# EAGLE design PCB ARDUINO NANO (EAGLE 9.6.2)
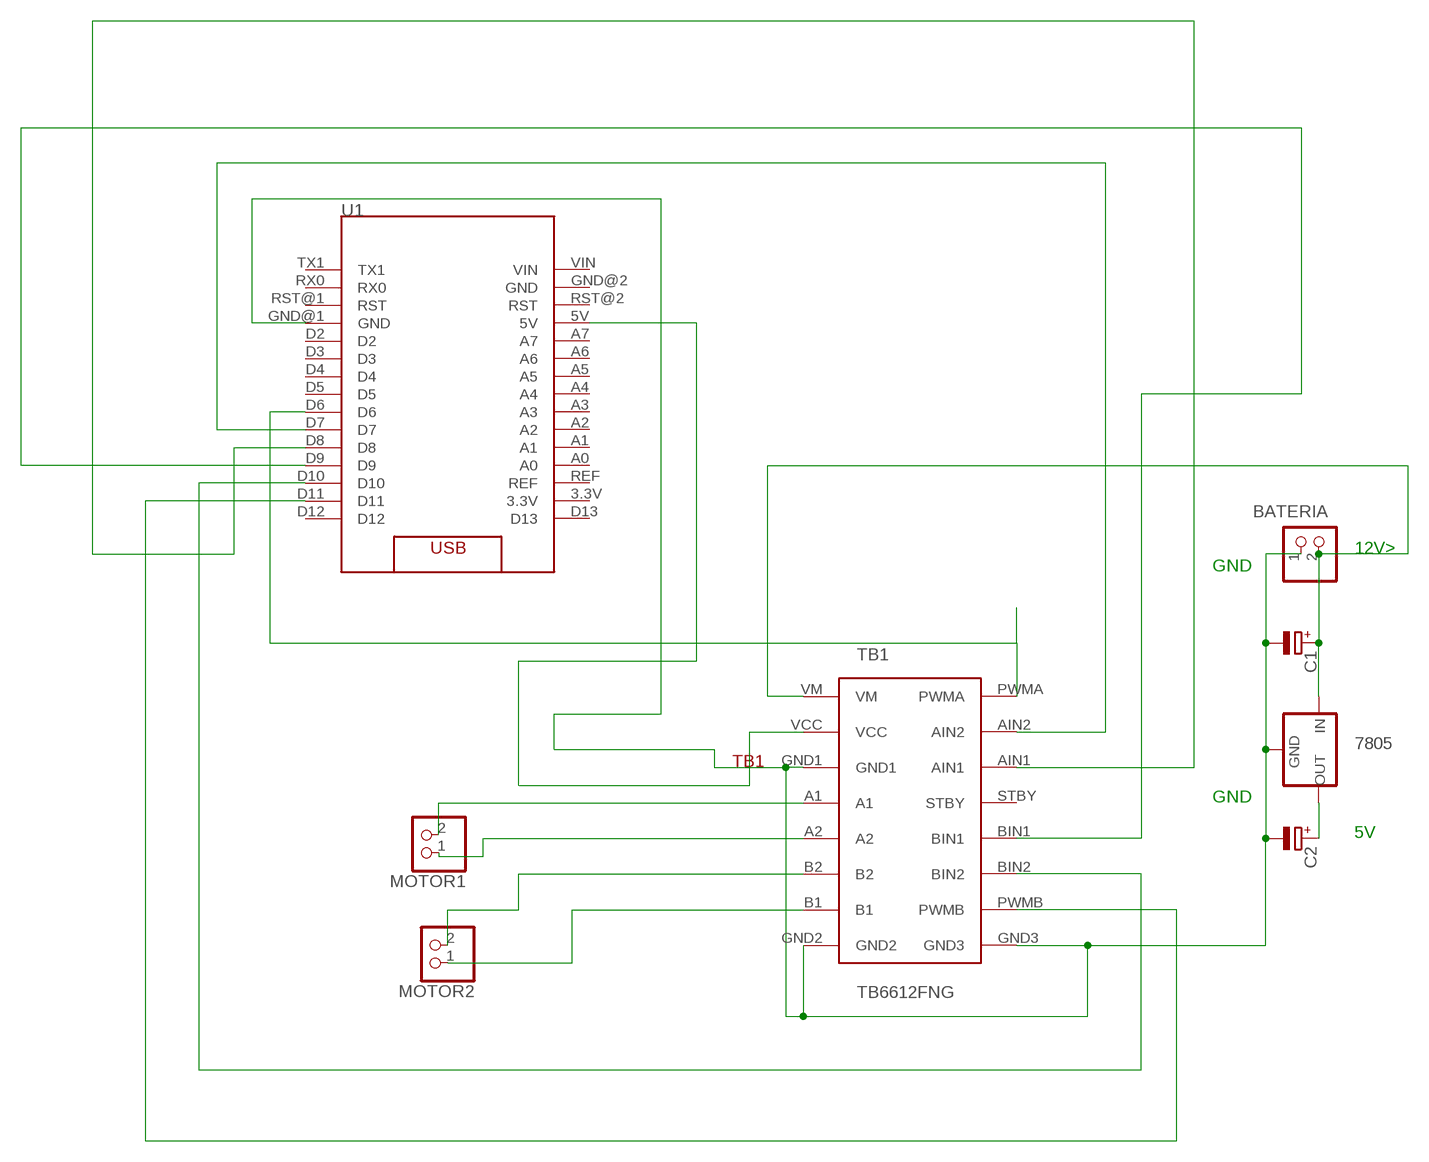
[diagram p0: schematic, sheet 1]

## Parts
7805  78XXS  [78XXS]
BATERIA  PINHD-1X2  [1X02]
C1  CPOL-EUE2.5-6  [E2,5-6]
C2  CPOL-EUE2.5-6  [E2,5-6]
MOTOR1  PINHD-1X2  [1X02]
MOTOR2  PINHD-1X2  [1X02]
TB1  TB6612FNG  [TB6612FNG]
U1  ARDUINO_NANO  [ARDUINO_NANO]

## Nets
N$1: MOTOR1.2 TB1.A1
N$2: 7805.IN BATERIA.2 C1.+ TB1.VM
N$3: 7805.OUT C2.+
N$4: TB1.VCC U1.5V
N$5: 7805.GND BATERIA.1 C1.- C2.- TB1.GND1 TB1.GND2 TB1.GND3 U1.GND@1(GND)
N$6: MOTOR1.1 TB1.A2
N$7: MOTOR2.2 TB1.B2
N$8: MOTOR2.1 TB1.B1
N$9: TB1.PWMA U1.D6
N$10: TB1.AIN2 U1.D7
N$11: TB1.AIN1 U1.D8
N$12: TB1.BIN1 U1.D9
N$13: TB1.BIN2 U1.D10
N$14: TB1.PWMB U1.D11
Unconnected: TB1.STBY U1.3.3V U1.A0 U1.A1 U1.A2 U1.A3 U1.A4 U1.A5 U1.A6 U1.A7 U1.D2 U1.D3 U1.D4 U1.D5 U1.D12 U1.D13 U1.GND@2(GND) U1.REF U1.RST@1(RST) U1.RST@2(RST) U1.RX0 U1.TX1 U1.VIN

## Notes on the sheet
- 12V>
- GND
- GND
- 5V

## Library data of the parts
7805 = v-reg:78XXS: VOLTAGE REGULATOR
BATERIA MOTOR1 MOTOR2 = pinhead:PINHD-1X2: PIN HEADER
C1 C2 = rcl:CPOL-EU: POLARIZED CAPACITOR, European symbol; SPICEPREFIX: C
TB1 = TB6612FNG:TB6612FNG
U1 = ArduinoNanoV2:ARDUINO_NANO: Arduino Nano Device

## Board
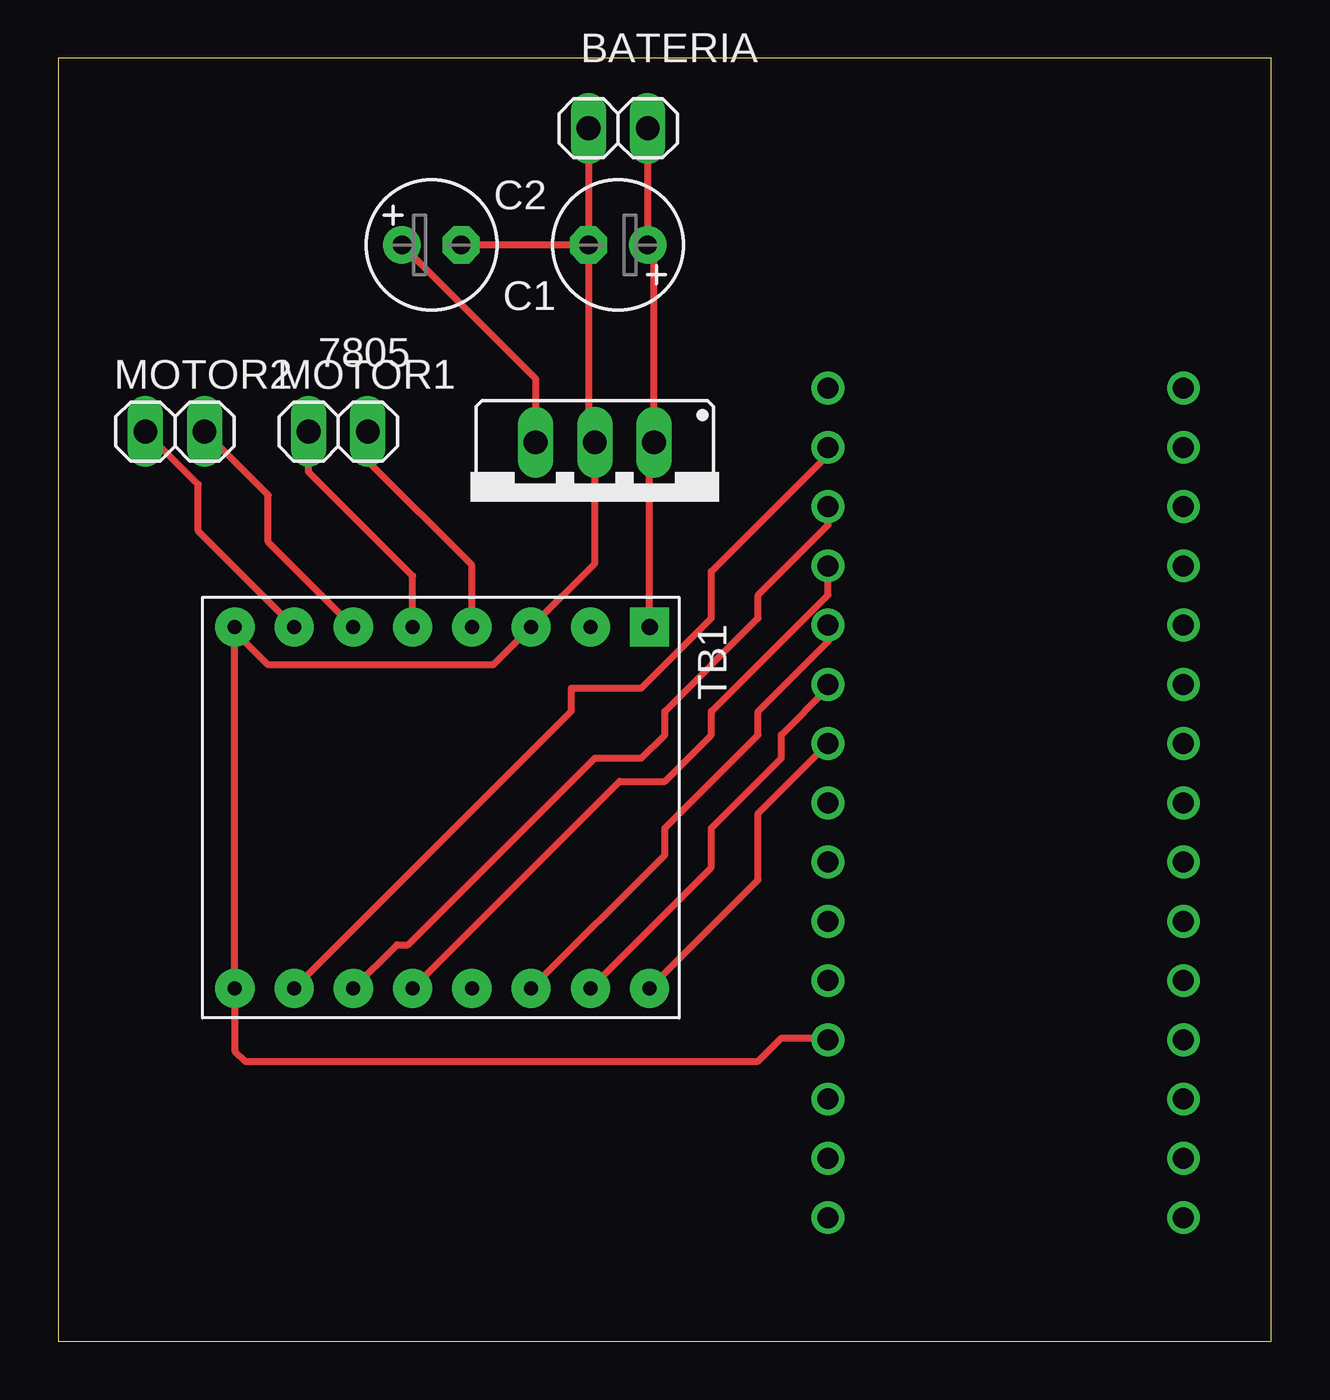
[diagram p1: board, top side]
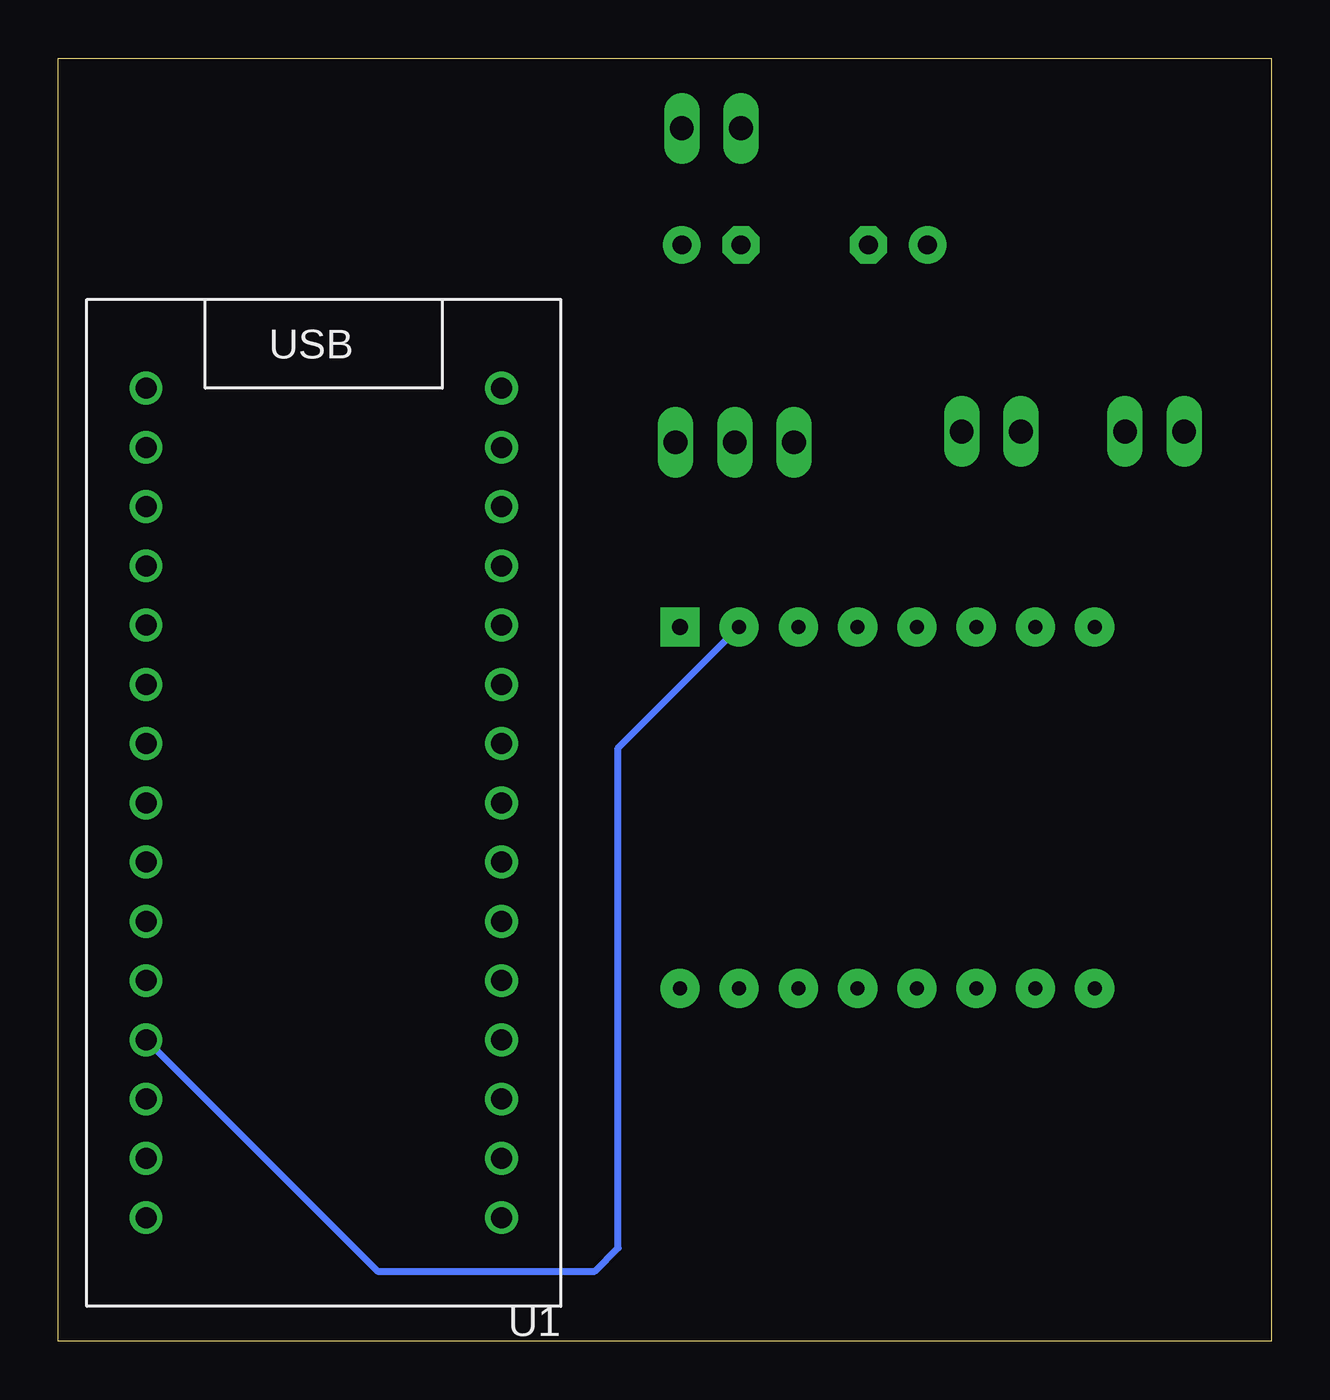
[diagram p2: board, bottom side, seen from below]

Size 52 x 55 mm. Coordinates in mm from the lower left corner, seen from the top.
Outline: 0,0 52,0 52,55 0,55 0,0
Copper layers (1*16): Top 0.035mm / dielectric 1.5mm / Bottom 0.035mm
Design rules "default": minimum track width 6mil, minimum drill 0.35mm, track to track 6mil, track to pad 6mil, pad to pad 6mil, via to via 6mil, smd to smd 6mil, copper to edge 40mil, drill to drill 6mil, minimum pad ring 10mil, minimum via ring 8mil, stop-mask expansion 4mil, vias tented up to drill 0mil, thermal gap 10mil

### Footprints (pad centres in the part's own frame; a part is rotated, then mirrored left to right if it is on the bottom)
78XXS = drill 1.016 long: GND 0,-2.54; IN -2.54,-2.54; OUT 2.54,-2.54
1X02 = drill 1.016 long: 1 -1.27,0; 2 1.27,0
E2,5-6 = drill 0.813 pad 1.6: + -1.27,0 | drill 0.813 pad 1.6 octagon: - 1.27,0
TB6612FNG = drill 0.6 pad 1.676: A1 -7.62,-1.27; A2 -7.62,-3.81; AIN1 7.874,1.27; AIN2 7.874,3.81; B1 -7.62,-8.89; B2 -7.62,-6.35; BIN1 7.874,-3.81; BIN2 7.874,-6.35; GND1 -7.62,1.27; GND2 -7.62,-11.43; GND3 7.874,-11.43; PWMA 7.874,6.35; PWMB 7.874,-8.89; STBY 7.874,-1.27; VCC -7.62,3.81 | drill 0.7 pad 1.676 square: VM -7.62,6.35
ARDUINO_NANO = drill 0.9: 3.3V 15.24,-20.32; 5V 15.24,5.08; A0 15.24,-15.24; A1 15.24,-12.7; A2 15.24,-10.16; A3 15.24,-7.62; A4 15.24,-5.08; A5 15.24,-2.54; A6 15.24,0; A7 15.24,2.54; D2 0,2.54; D3 0,0; D4 0,-2.54; D5 0,-5.08; D6 0,-7.62; D7 0,-10.16; D8 0,-12.7; D9 0,-15.24; D10 0,-17.78; D11 0,-20.32; D12 0,-22.86; D13 15.24,-22.86; GND@1 0,5.08; GND@2 15.24,10.16; REF 15.24,-17.78; RST@1 0,7.62; RST@2 15.24,7.62; RX0 0,10.16; TX1 0,12.7; VIN 15.24,12.7

### Placement (x,y rotation side)
7805  23,36 180 top
BATERIA  24,52 0 top
C1  24,47 180 top
C2  16,47 0 top
MOTOR1  12,39 0 top
MOTOR2  5,39 0 top
TB1  19,23 270 top
U1  33,18 180 bottom

### Tracks (layer width: path | path; a pad name or v marks a point on that pad's centre or on a via)
N$1
  Top 0.305: TB1.A1 17.73,33.27 13.27,37.73 MOTOR1.2
N$2
  Top 0.305: BATERIA.2 C1.+ 25.54,46.73 7805.IN 25.35,38.35 TB1.VM
N$3
  Top 0.305: C2.+ 20.46,41.27 7805.OUT
N$4
  Bottom 0.305: U1.5V 38.32,3 29,3 28,4 28,25.43 TB1.VCC
N$5
  Top 0.305: BATERIA.1 C1.- | C1.- C2.- | C1.- 22.73,38.81 7805.GND 23,33.35 TB1.GND1 18.65,29 9,29 7.57,30.43 | 7.57,30.43 TB1.GND3 7.57,12.43 8,12 30,12 31,13 32.92,13 U1.GND@1 | 7.57,30.43 7,31 | 7.57,30.43 TB1.GND2
N$6
  Top 0.305: TB1.A2 15.19,32.81 10.73,37.27 MOTOR1.1
N$7
  Top 0.305: TB1.B2 9,34.27 9,36.27 MOTOR2.2
N$8
  Top 0.305: TB1.B1 6,34.73 6,36.73 MOTOR2.1
N$9
  Top 0.305: TB1.PWMA 30,19.78 30,22.62 U1.D6
N$10
  Top 0.305: TB1.AIN2 28,20.32 28,22 31,25 31,26 33,28 U1.D7
N$11
  Top 0.305: TB1.AIN1 26,20.86 26,22 30,26 30,27 33,30 U1.D8
N$12
  Top 0.305: TB1.BIN1 24.06,24 26,24 28,26 28,27 33,32 U1.D9
N$13
  Top 0.305: TB1.BIN2 14.52,17 15,17 23,25 25,25 26,26 26,27 30,31 30,32 33,35 U1.D10
N$14
  Top 0.305: TB1.PWMB 22,27.02 22,28 25,28 28,31 28,33 33,38 U1.D11